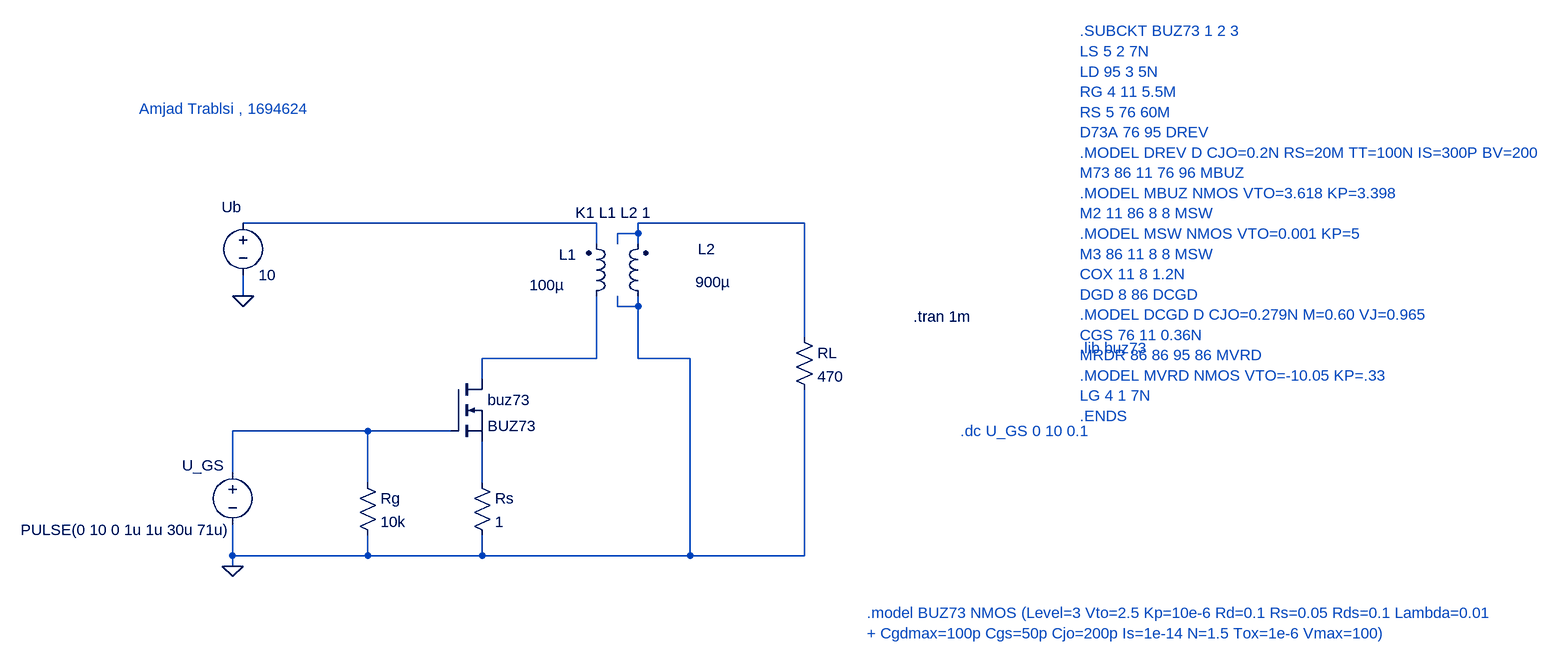
[diagram p0: schematic E8_1.asc]
E8_1.asc, the LTspice schematic file:
Version 4
SHEET 1 1976 1192
WIRE 544 160 0 160
WIRE 864 160 608 160
WIRE 608 176 608 160
WIRE 608 176 576 176
WIRE 544 192 544 160
WIRE 576 192 576 176
WIRE 608 192 608 176
WIRE 0 272 0 240
WIRE 576 288 576 272
WIRE 608 288 608 272
WIRE 608 288 576 288
WIRE 864 336 864 160
WIRE 544 368 544 272
WIRE 544 368 368 368
WIRE 608 368 608 288
WIRE 688 368 608 368
WIRE 368 400 368 368
WIRE 192 480 -16 480
WIRE 320 480 192 480
WIRE -16 544 -16 480
WIRE 192 560 192 480
WIRE 368 560 368 496
WIRE -16 672 -16 624
WIRE 192 672 192 640
WIRE 192 672 -16 672
WIRE 368 672 368 640
WIRE 368 672 192 672
WIRE 688 672 688 368
WIRE 688 672 368 672
WIRE 864 672 864 416
WIRE 864 672 688 672
WIRE -16 688 -16 672
FLAG -16 688 0
FLAG 0 272 0
SYMBOL voltage 0 144 R0
WINDOW 0 -33 -9 Left 2
WINDOW 123 0 0 Left 0
WINDOW 39 0 0 Left 0
SYMATTR InstName Ub
SYMATTR Value 10
SYMBOL voltage -16 528 R0
WINDOW 0 -78 5 Left 2
WINDOW 3 -326 104 Left 2
WINDOW 123 0 0 Left 0
WINDOW 39 0 0 Left 0
SYMATTR InstName U_GS
SYMATTR Value PULSE(0 10 0 1u 1u 30u 71u)
SYMBOL res 176 544 R0
SYMATTR InstName Rg
SYMATTR Value 10k
SYMBOL res 352 544 R0
SYMATTR InstName Rs
SYMATTR Value 1
SYMBOL nmos 320 400 R0
SYMATTR InstName buz73
SYMATTR Value BUZ73
SYMBOL ind2 528 288 M180
WINDOW 0 -42 80 Left 2
WINDOW 3 -87 33 Left 2
SYMATTR InstName L1
SYMATTR Value 100µ
SYMBOL ind2 624 288 R180
WINDOW 0 -103 88 Left 2
WINDOW 3 -126 37 Left 2
SYMATTR InstName L2
SYMATTR Value 900µ
SYMBOL res 848 320 R0
SYMATTR InstName RL
SYMATTR Value 470
TEXT 512 144 Left 2 !K1 L1 L2 1
TEXT 1032 304 Left 2 !.tran 1m
TEXT -160 -16 Left 2 ;Amjad Trablsi , 1694624
TEXT 960 760 Left 2 ;.model BUZ73 NMOS (Level=3 Vto=2.5 Kp=10e-6 Rd=0.1 Rs=0.05 Rds=0.1 Lambda=0.01\n+ Cgdmax=100p Cgs=50p Cjo=200p Is=1e-14 N=1.5 Tox=1e-6 Vmax=100)
TEXT 1104 480 Left 2 ;.dc U_GS 0 10 0.1
TEXT 1288 352 Left 2 ;.lib buz73
TEXT 1288 -136 Left 2 ;.SUBCKT BUZ73 1 2 3\nLS 5 2 7N\nLD 95 3 5N\nRG 4 11 5.5M\nRS 5 76 60M\nD73A 76 95 DREV\n.MODEL DREV D CJO=0.2N RS=20M TT=100N IS=300P BV=200\nM73 86 11 76 96 MBUZ\n.MODEL MBUZ NMOS VTO=3.618 KP=3.398\nM2 11 86 8 8 MSW\n.MODEL MSW NMOS VTO=0.001 KP=5\nM3 86 11 8 8 MSW\nCOX 11 8 1.2N\nDGD 8 86 DCGD\n.MODEL DCGD D CJO=0.279N M=0.60 VJ=0.965\nCGS 76 11 0.36N\nMRDR 86 86 95 86 MVRD\n.MODEL MVRD NMOS VTO=-10.05 KP=.33\nLG 4 1 7N\n.ENDS

The netlist it stands for:
* E8_1.asc
V§Ub N001 0 10
V§U_GS N004 0 PULSE(0 10 0 1u 1u 30u 71u)
Rg N004 0 10k
Rs N005 0 1
M§buz73 N003 N004 N005 N005 BUZ73
L1 N003 N001 100µ
L2 0 N002 900µ
RL N002 0 470
.model NMOS NMOS
.model PMOS PMOS
.lib standard.mos
K1 L1 L2 1
.tran 1m
* Amjad Trablsi , 1694624
* .model BUZ73 NMOS (Level=3 Vto=2.5 Kp=10e-6 Rd=0.1 Rs=0.05 Rds=0.1 Lambda=0.01
* + Cgdmax=100p Cgs=50p Cjo=200p Is=1e-14 N=1.5 Tox=1e-6 Vmax=100)
* .dc U_GS 0 10 0.1
* .lib buz73
* .SUBCKT BUZ73 1 2 3
* LS 5 2 7N
* LD 95 3 5N
* RG 4 11 5.5M
* RS 5 76 60M
* D73A 76 95 DREV
* .MODEL DREV D CJO=0.2N RS=20M TT=100N IS=300P BV=200
* M73 86 11 76 96 MBUZ
* .MODEL MBUZ NMOS VTO=3.618 KP=3.398
* M2 11 86 8 8 MSW
* .MODEL MSW NMOS VTO=0.001 KP=5
* M3 86 11 8 8 MSW
* COX 11 8 1.2N
* DGD 8 86 DCGD
* .MODEL DCGD D CJO=0.279N M=0.60 VJ=0.965
* CGS 76 11 0.36N
* MRDR 86 86 95 86 MVRD
* .MODEL MVRD NMOS VTO=-10.05 KP=.33
* LG 4 1 7N
* .ENDS
.backanno
.end